# Altium schematic sheet Raspberry Pi 3 A+.SchDoc
size A4; Version: V 1.0  Rev A
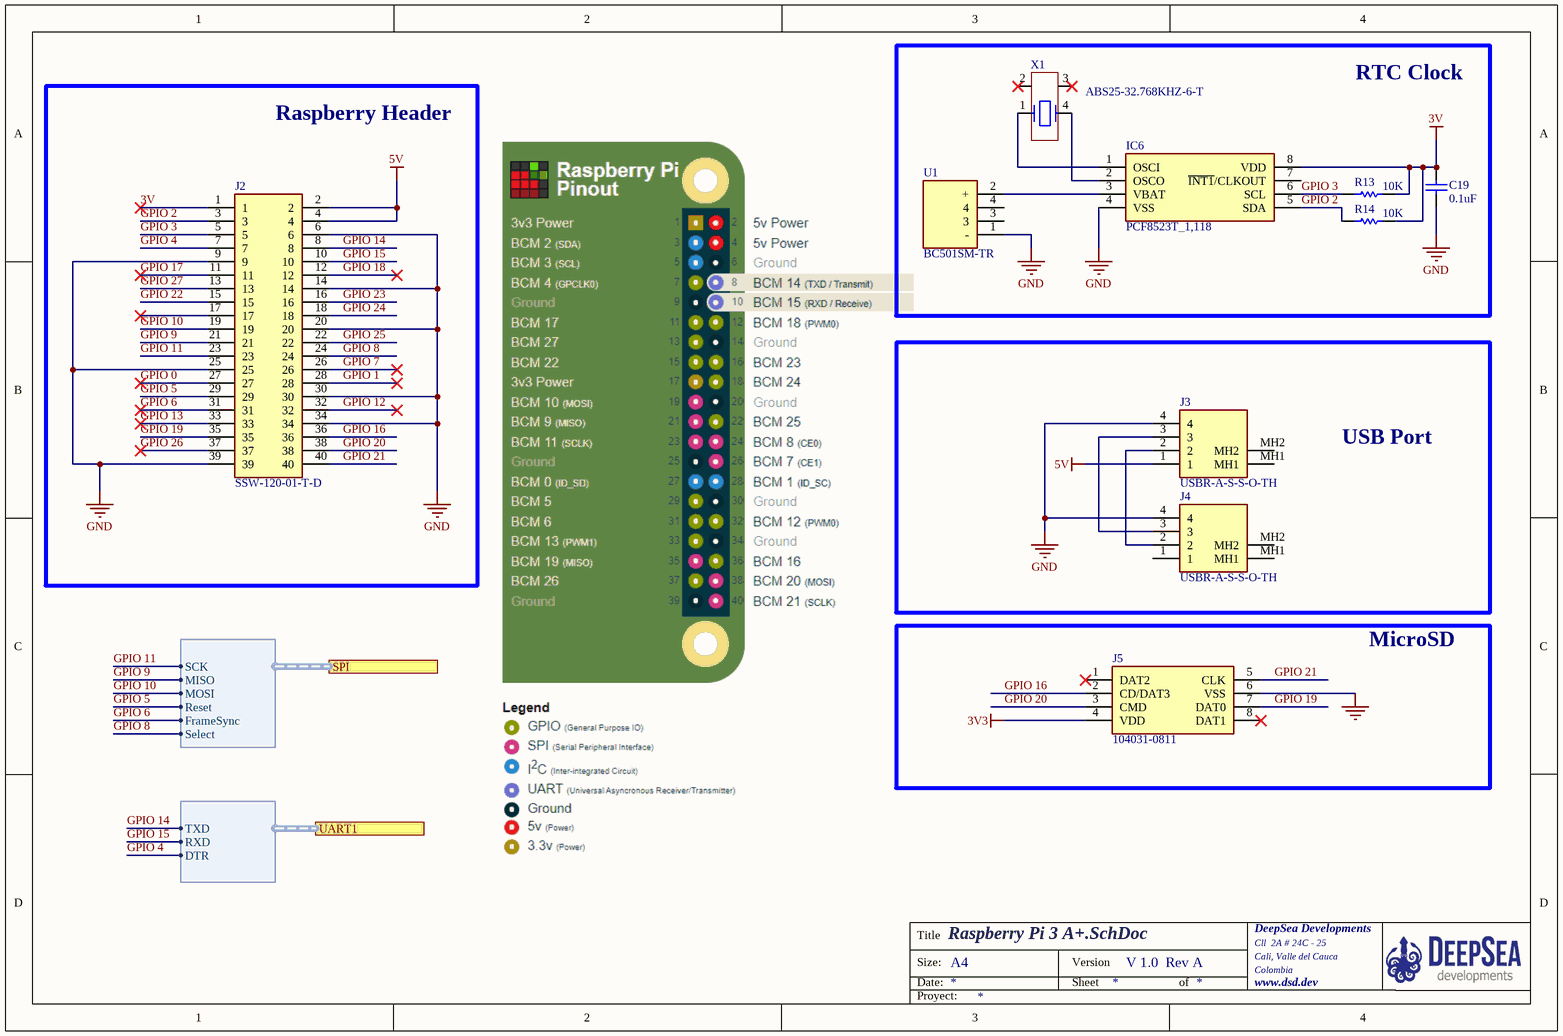
[diagram p0: Raspberry Pi 3 A+.SchDoc]

## Parts
C19  0.1uF  [C0603_L]
IC6  PCF8523T_1,118  [SOIC127P600X175-8N]
J2  SSW-120-01-T-D  [RHDR40W79P254_2X20_5131X495X851P]
J3  USBR-A-S-S-O-TH  [USB_A]
J4  USBR-A-S-S-O-TH  [USB_A]
J5  104031-0811  [1040310811]
R13  10K  [R0603_L]
R14  10K  [R0603_L]
U1  BC501SM-TR  [BC501SMTR]
X1  ABS25-32.768KHZ-6-T  [ABS25]

## Blocks framed on the sheet
Raspberry Header: J2
RTC Clock: C19 IC6 R13 R14 U1 X1
USB Port: J3 J4
MicroSD: J5

## Ports
SPI (harness SPI), UART1 (harness UART1)

## Harnesses
SPI: SCK, MISO, MOSI, Reset, FrameSync, Select
UART1: TXD, RXD, DTR

## Nets
3V: C19.2 IC6.8(VDD) J2.1 R13.2 R14.2
3V3: J5.4(VDD)
5V: J2.2 J2.4 J3.1
GND: C19.1 IC6.4(VSS) J2.6 J2.9 J2.14 J2.20 J2.25 J2.30 J2.34 J2.39 J3.4 J4.4 J5.6(VSS) U1.1(-)
GPIO 0: J2.27
GPIO 1: J2.28
GPIO 2: IC6.5(SDA) J2.3 R14.1
GPIO 3: IC6.6(SCL) J2.5 R13.1
GPIO 4: J2.7 ; port UART1.DTR
GPIO 5: J2.29 ; port SPI.Reset
GPIO 6: J2.31 ; port SPI.FrameSync
GPIO 7: J2.26
GPIO 8: J2.24 ; port SPI.Select
GPIO 9: J2.21 ; port SPI.MISO
GPIO 10: J2.19 ; port SPI.MOSI
GPIO 11: J2.23 ; port SPI.SCK
GPIO 12: J2.32
GPIO 13: J2.33
GPIO 14: J2.8 ; port UART1.TXD
GPIO 15: J2.10 ; port UART1.RXD
GPIO 16: J2.36 J5.2(CD/DAT3)
GPIO 17: J2.11
GPIO 18: J2.12
GPIO 19: J2.35 J5.7(DAT0)
GPIO 20: J2.38 J5.3(CMD)
GPIO 21: J2.40 J5.5(CLK)
GPIO 22: J2.15
GPIO 23: J2.16
GPIO 24: J2.18
GPIO 25: J2.22
GPIO 26: J2.37
GPIO 27: J2.13
NetIC6_1: IC6.1(OSCI) X1.1
NetIC6_2: IC6.2(OSCO) X1.4
NetIC6_3: IC6.3(VBAT) U1.2(+)
NetJ3_2: J3.2 J4.2
NetJ3_3: J3.3 J4.3

Not connected (* = marked no-connect by the designer): IC6 7(~{INT1}/CLKOUT); J2 17*; J3 MH1 MH2; J4 1 MH1 MH2; J5 1(DAT2)* 8(DAT1)*; U1 3 4; X1 2* 3*

## Notes on the sheet
- Title
- Size:
- Date:
- A4
- Version
- Sheet
- of
- DeepSea Developments
- Cll  2A # 24C - 25
- Cali, Valle del Cauca
- Colombia
- www.dsd.dev
- Proyect:

## Library data of the parts
C19 = C_SMD: Value: 0.1uF
IC6 = PCF8523T_1,118: Integrated Circuit; Manufacturer_Name: NXP; Manufacturer_Part_Number: PCF8523T/1,118; Datasheet Link: https://mouser.componentsearchengine.com/Datasheets/2/PCF8523T_1,118.pdf; Height: 1.75mm; Arrow Part Number: PCF8523T/1,118; Arrow Price/Stock: https://www.arrow.com/en/products/pcf8523t1118/nxp-semiconductors; Mouser Part Number: 771-PCF8523T/1118; Mouser Price/Stock: https://www.mouser.co.uk/ProductDetail/NXP-Semiconductors/PCF8523T-1118?qs=beN0Cyoe8YmmXShRMIPCwg%3D%3D
J2 = SSW-120-01-T-D: Connector; Manufacturer_Name: SAMTEC; Datasheet Link: https://mouser.componentsearchengine.com/Datasheets/2/SSW-120-01-T-D.pdf; Height: 8.51mm; Manufacturer_Part_Number: SSW-120-01-T-D; Mouser Part Number: 200-SSW12001TD; Mouser Price/Stock: https://www.mouser.co.uk/ProductDetail/Samtec/SSW-120-01-T-D?qs=rkdpAy2aP%2F%252BUeUPwq%252BhQGQ%3D%3D; RS Part Number: 1800457; RS Price/Stock: http://uk.rs-online.com/web/p/products/1800457
J3 J4 = USBR-A-S-S-O-TH: Connector; Manufacturer_Name: SAMTEC; Datasheet Link: http://suddendocs.samtec.com/prints/usbr-a-s-x-x-th-x-mkt.pdf; Height: 7.08mm; Manufacturer_Part_Number: USBR-A-S-S-O-TH; Mouser Part Number: 200-USBRASSOTH; Mouser Price/Stock: https://www.mouser.co.uk/ProductDetail/Samtec/USBR-A-S-S-O-TH?qs=rHlcMk0NooKn9e8hD2pFtg%3D%3D; RS Part Number: 1800517; RS Price/Stock: http://uk.rs-online.com/web/p/products/1800517
J5 = 104031-0811: Connector; Manufacturer_Name: Molex; Allied_Number: 70747077; Datasheet Link: http://www.molex.com/webdocs/datasheets/pdf/en-us/1040310811_MEMORY_CARD_SOCKET.pdf; Manufacturer_Part_Number: 104031-0811; Mouser Part Number: 538-104031-0811; Mouser Price/Stock: https://www.mouser.com/Search/Refine.aspx?Keyword=538-104031-0811; RS Part Number: 8967560; RS Price/Stock: http://uk.rs-online.com/web/p/products/8967560; Allied Price/Stock: http://www.alliedelec.com/molex-incorporated-104031-0811/70747077/
R13 R14 = R_SMD: Value: 10K
U1 = BC501SM-TR: Undefined or Miscellaneous; Manufacturer_Name: MPD (Memory Protection Devices); Datasheet Link: http://www.memoryprotectiondevices.com/datasheets/BC501SM-datasheet.pdf; Height: 4mm; Manufacturer_Part_Number: BC501SM-TR; Arrow Part Number: BC501SM-TR
X1 = MC306